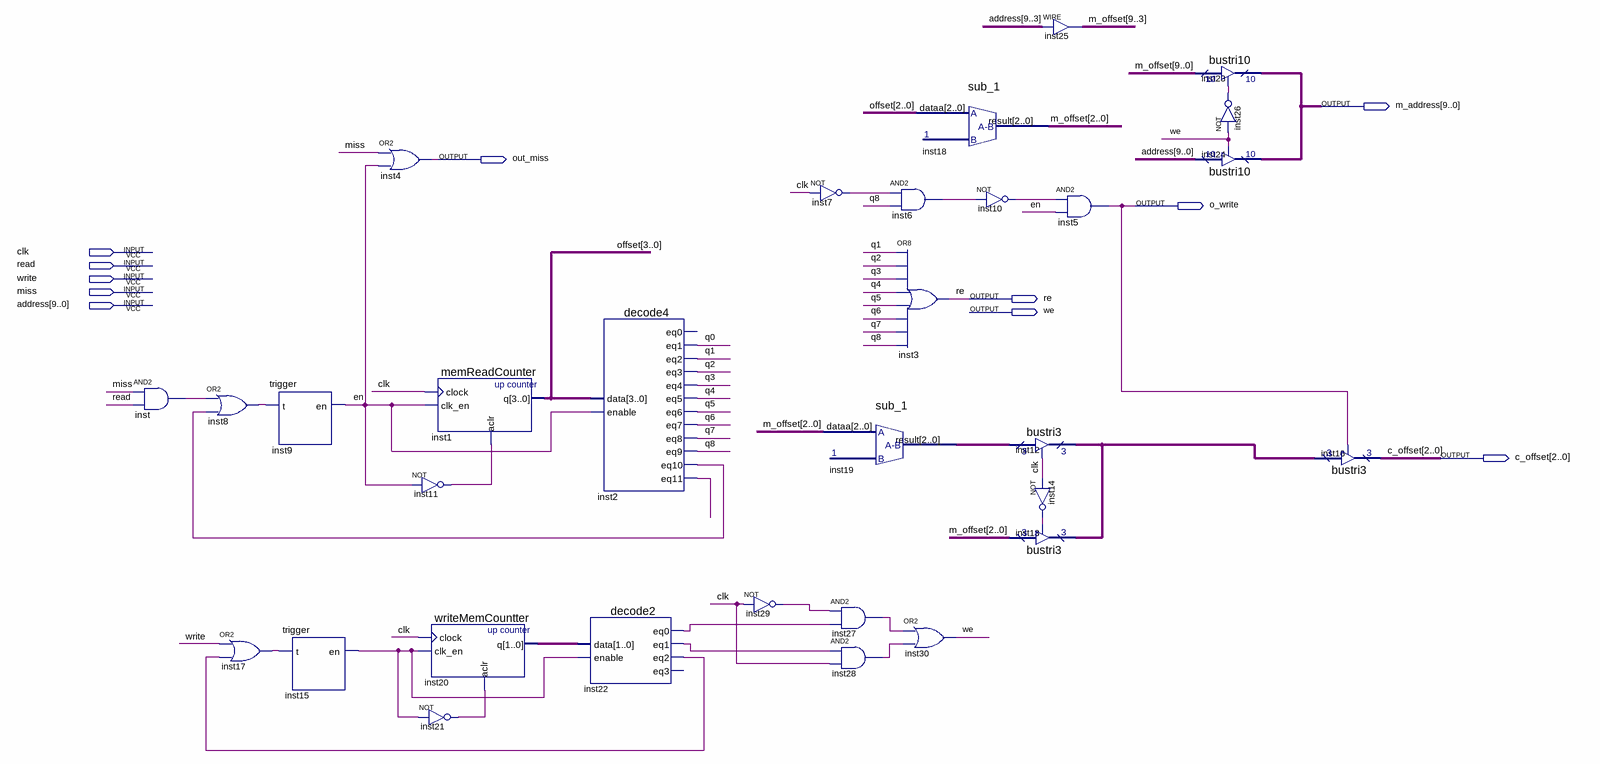
[diagram p0: schematic sheet]
// Quartus schematic cacheControllBlock.bdf as structural Verilog: 31 symbols, 11 pins
module cacheControllBlock (
  input  clk,
  input  read,
  input  write,
  input  miss,
  input  [9:0] address,
  output [9:0] m_address,
  output out_miss,
  output o_write,
  output re,
  output we,
  output [2:0] c_offset
);

  wire en, inst2_eq10, inst2_eq11, inst6_out, inst7_out, inst8_out, inst10_out, inst11_out, inst14_out,
       inst15_en, inst17_out, inst21_out, inst22_eq0, inst22_eq1, inst22_eq2, inst26_out, inst27_out,
       inst28_out, inst29_out, inst_out, q0, q1, q2, q3, q4, q5, q6, q7, q8;
  wire [1:0] inst20_q;
  wire [2:0] inst12_tridata, inst19_result;
  wire [3:0] offset;
  wire [9:0] m_offset;

  and inst (inst_out, miss, read);
  or inst8 (inst8_out, inst_out, inst2_eq10);
  or inst17 (inst17_out, write, inst22_eq2);
  trigger inst9 (.t(inst8_out), .en(en));
  trigger inst15 (.t(inst17_out), .en(inst15_en));
  or inst4 (out_miss, miss, en);
  memReadCounter inst1 (.clock(clk), .clk_en(en), .aclr(inst11_out), .q(offset));
  not inst11 (inst11_out, en);
  writeMemCountter inst20 (.clock(clk), .clk_en(inst15_en), .aclr(inst21_out), .q(inst20_q));
  not inst21 (inst21_out, inst15_en);
  decode4 inst2 (
    .data(offset), .enable(en), .eq1(q0), .eq2(q1), .eq3(q2), .eq4(q3), .eq5(q4), .eq6(q5), .eq7(q6),
    .eq8(q7), .eq9(q8), .eq10(inst2_eq10), .eq11(inst2_eq11));  // open: eq0
  decode2 inst22 (
    .data(inst20_q), .enable(inst15_en), .eq0(inst22_eq0), .eq1(inst22_eq1), .eq2(inst22_eq2));  // open: eq3
  not inst29 (inst29_out, clk);
  not inst7 (inst7_out, clk);
  sub_1 inst19 (.dataa(m_offset[2:0]), .result(inst19_result));
  and inst27 (inst27_out, inst29_out, inst22_eq0);
  and inst28 (inst28_out, inst22_eq1, clk);
  sub_1 inst18 (.dataa(offset[2:0]), .result(m_offset[2:0]));
  and inst6 (inst6_out, inst7_out, q8);
  or inst3 (re, q1, q2, q3, q4, q5, q6, q7, q8);
  or inst30 (we, inst27_out, inst28_out);
  not inst10 (inst10_out, inst6_out);
  bustri3 inst12 (.enabledt(clk), .data(inst19_result), .tridata(inst12_tridata));
  bustri3 inst13 (.enabledt(inst14_out), .data(m_offset[2:0]), .tridata(inst12_tridata));
  assign m_offset[9:3] = address[9:3];  // WIRE inst25
  and inst5 (o_write, inst10_out, en);
  not inst14 (inst14_out, clk);
  bustri10 inst23 (.enabledt(inst26_out), .data(m_offset), .tridata(m_address));
  not inst26 (inst26_out, we);
  bustri10 inst24 (.enabledt(we), .data(address), .tridata(m_address));
  bustri3 inst16 (.enabledt(o_write), .data(inst12_tridata), .tridata(c_offset));
endmodule
